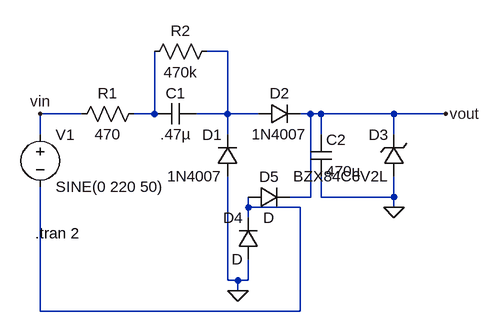
[diagram p0: schematic transformerless_power_supply.asc]
transformerless_power_supply.asc, the LTspice schematic file:
Version 4
SHEET 1 880 680
WIRE 144 32 112 32
WIRE -80 128 -144 128
WIRE 32 128 32 32
WIRE 32 128 0 128
WIRE 144 128 144 32
WIRE 144 128 96 128
WIRE 192 128 144 128
WIRE 272 128 256 128
WIRE 288 128 272 128
WIRE 400 128 288 128
WIRE 480 128 400 128
WIRE -144 160 -144 128
WIRE 144 160 144 128
WIRE 288 160 288 128
WIRE 400 160 400 128
WIRE 272 256 272 128
WIRE 272 256 240 256
WIRE 288 256 288 224
WIRE 400 256 400 224
WIRE 400 256 288 256
WIRE 176 272 176 256
WIRE 256 272 176 272
WIRE 400 272 400 256
WIRE 176 288 176 272
WIRE 144 384 144 224
WIRE 160 384 144 384
WIRE 176 384 176 352
WIRE 176 384 160 384
WIRE 160 400 160 384
WIRE -144 432 -144 240
WIRE 256 432 256 272
WIRE 256 432 -144 432
FLAG 400 272 0
FLAG 480 128 vout
FLAG -144 128 vin
FLAG 160 400 0
SYMBOL diode 160 224 R180
WINDOW 0 24 64 Left 2
WINDOW 3 24 0 Left 2
SYMATTR InstName D1
SYMATTR Value 1N4007
SYMBOL diode 192 144 R270
WINDOW 0 32 32 VTop 2
WINDOW 3 0 32 VBottom 2
SYMATTR InstName D2
SYMATTR Value 1N4007
SYMBOL voltage -144 144 R0
WINDOW 123 0 0 Left 0
WINDOW 39 0 0 Left 0
SYMATTR InstName V1
SYMATTR Value SINE(0 220 50)
SYMBOL cap 96 112 R90
WINDOW 0 0 32 VBottom 2
WINDOW 3 32 32 VTop 2
SYMATTR InstName C1
SYMATTR Value .47µ
SYMBOL cap 272 160 R0
SYMATTR InstName C2
SYMATTR Value 470µ
SYMBOL res 16 112 R90
WINDOW 0 0 56 VBottom 2
WINDOW 3 32 56 VTop 2
SYMATTR InstName R1
SYMATTR Value 470
SYMBOL res 128 16 R90
WINDOW 0 0 56 VBottom 2
WINDOW 3 32 56 VTop 2
SYMATTR InstName R2
SYMATTR Value 470k
SYMBOL zener 416 224 R180
WINDOW 0 24 64 Left 2
WINDOW 3 24 0 Left 2
SYMATTR InstName D3
SYMATTR Value BZX84C6V2L
SYMATTR Description Diode
SYMATTR Type diode
SYMBOL diode 192 352 R180
WINDOW 0 24 64 Left 2
WINDOW 3 24 0 Left 2
SYMATTR InstName D4
SYMBOL diode 176 272 R270
WINDOW 0 32 32 VTop 2
WINDOW 3 0 32 VBottom 2
SYMATTR InstName D5
TEXT -152 312 Left 2 !.tran 2

The netlist it stands for:
* transformerless_power_supply.asc
D1 0 N001 1N4007
D2 N001 vout 1N4007
V1 vin N003 SINE(0 220 50)
C1 N001 N002 .47µ
C2 vout 0 470µ
R1 N002 vin 470
R2 N001 N002 470k
D3 0 vout BZX84C6V2L
D4 0 N003 D
D5 N003 vout D
.model D D
.lib standard.dio
.tran 2
.backanno
.end